# Altium schematic sheet SoC_PS_Config_503.SchDoc: RFSoC AMC
size 420 x 297 mm; CompanyName: WUT; DrawnBy: T. Przywozki; Organization: WUT ISE; Address1: Warsaw University of Technology; Address2: Nowowiejska 15/19 00-665 Warsaw; Address3: Tomasz.Przywozki@pw.edu.pl; DocumentNumber: 9; Revision: 1; SheetNumber: 9; SheetTotal: 45; Project: RFSoC AMC; ModifiedBy: T. Przywozki; CreateDate: -; CheckedDate: -; DivGrp: ISE; Designer: T. Przywozki; ModifiedDate: -; ProjectName: ADC/DAC MEZZANINE
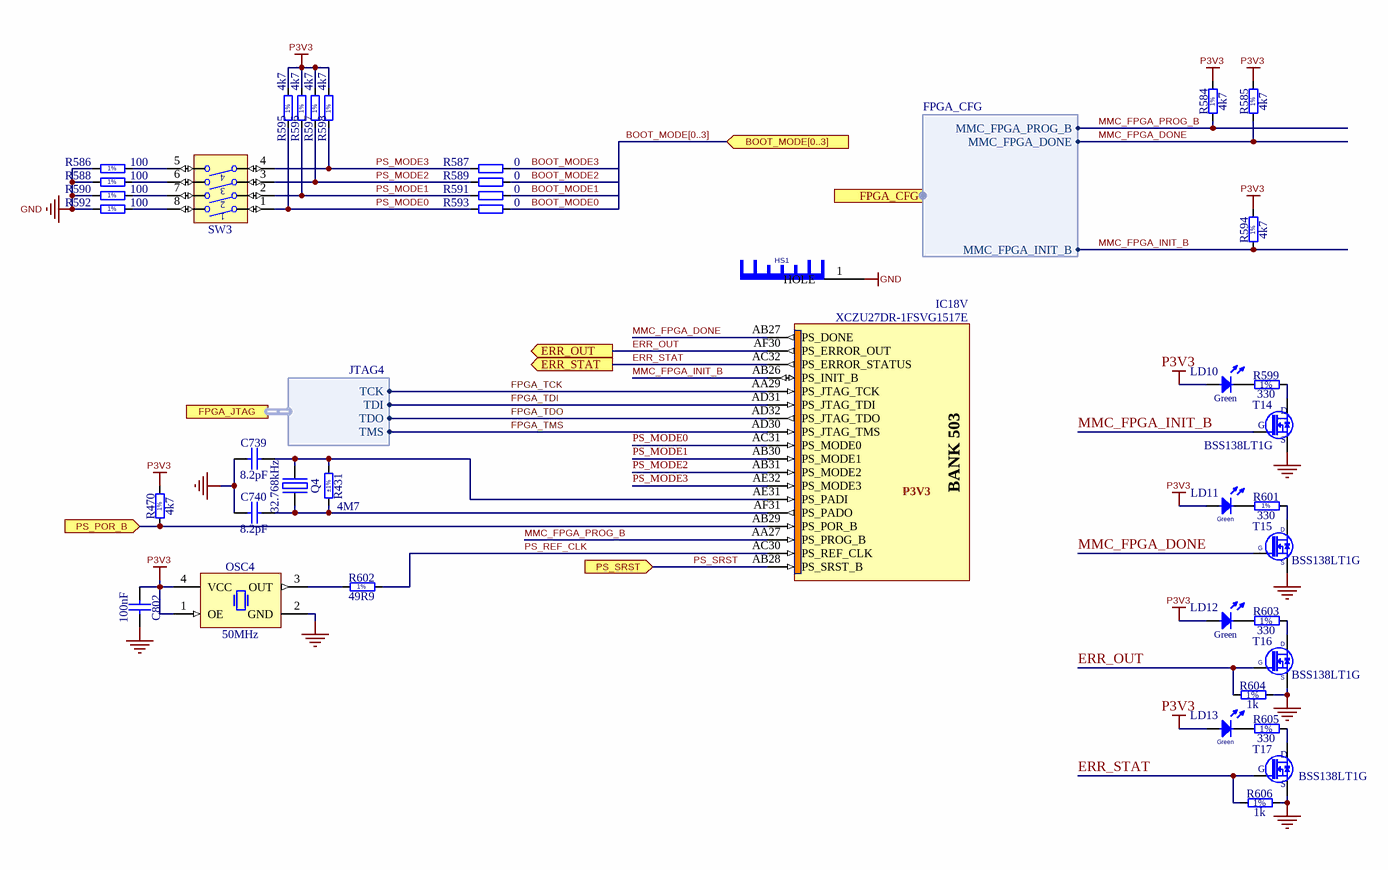
[diagram p0: SoC_PS_Config_503.SchDoc]

## Parts
C739  8.2pF  [CAPC1005X55N]
C740  8.2pF  [CAPC1005X55N]
C802  100nF  [CAPC0603X33N]
HS1  Heat Sink No Pad  [HSINK_WAKEFIELD_SKV585811-CU]  (value not drawn)
IC18  XCZU27DR-1FSVG1517E  [XILINX_FSVG1517 (XCZU27DR)]  (part V of 31)
LD10  Green  [LED_AVAGO_HSME-C120]
LD11  Green  [LED_AVAGO_HSME-C120]
LD12  Green  [LED_KINGBRIGHT_KPH-1608CGCK]
LD13  Green  [LED_KINGBRIGHT_KPH-1608CGCK]
OSC4  50MHz  [OSCSC254P320X500X130-4N]
Q4  32.768kHz  [XTAL_ABRACON_ABS06]
R431  4M7  Tolerance: ±1%  [RESC1005X40N]
R470  4k7  [RESC1005X40N]
R584  4k7  [RESC1005X40N]
R585  4k7  [RESC1005X40N]
R586  100  [RESC1005X40N]
R587  0  [RESC1005X40N]
R588  100  [RESC1005X40N]
R589  0  [RESC1005X40N]
R590  100  [RESC1005X40N]
R591  0  [RESC1005X40N]
R592  100  [RESC1005X40N]
R593  0  [RESC1005X40N]
R594  4k7  [RESC1005X40N]
R595  4k7  [RESC1005X40N]
R596  4k7  [RESC1005X40N]
R597  4k7  [RESC1005X40N]
R598  4k7  [RESC1005X40N]
R599  330  [RESC1005X40N]
R601  330  [RESC1005X40N]
R602  49R9  [RESC1005X40N]
R603  330  [RESC1005X40N]
R604  1k  [RESC1005X40N]
R605  330  [RESC1005X40N]
R606  1k  [RESC1005X40N]
SW3  Switch  [SW_TYCO_1571983-4]  (value not drawn)
T14  BSS138LT1G  [SOT95P240X110-3N]
T15  BSS138LT1G  [SOT95P240X110-3N]
T16  BSS138LT1G  [SOT95P240X110-3N]
T17  BSS138LT1G  [SOT95P240X110-3N]

## Ports
BOOT_MODE[0..3] (in), ERR_OUT (out), ERR_STAT (out), FPGA_CFG (harness FPGA_CFG), FPGA_JTAG (harness JTAG4), PS_POR_B (in), PS_SRST (in)

## Harnesses
JTAG4: TCK, TDI, TDO, TMS
FPGA_CFG: MMC_FPGA_PROG_B, MMC_FPGA_DONE, MMC_FPGA_INIT_B

## Nets
GND: C739.1 C740.1 C802.2 HS1.1(HOLE) OSC4.2(GND) R586.1 R588.1 R590.1 R592.1 R604.2 R606.2 T14.2(S) T15.2(S) T16.2(S) T17.2(S)
P3V3: C802.1 LD10.2(A) LD11.2(A) LD12.2(A) LD13.2(A) OSC4.1(OE) OSC4.4(VCC) R470.2 R584.2 R585.2 R594.2 R595.2 R596.2 R597.2 R598.2
BOOT_MODE0: R593.2
BOOT_MODE1: R591.2
BOOT_MODE2: R589.2
BOOT_MODE3: R587.2
ERR_OUT: IC18.AF30(PS_ERROR_OUT) R604.1 T16.1(G) ; port ERR_OUT
ERR_STAT: IC18.AC32(PS_ERROR_STATUS) R606.1 T17.1(G) ; port ERR_STAT
FPGA_TCK: IC18.AA29(PS_JTAG_TCK) ; port FPGA_JTAG.TCK
FPGA_TDI: IC18.AD31(PS_JTAG_TDI) ; port FPGA_JTAG.TDI
FPGA_TDO: IC18.AD32(PS_JTAG_TDO) ; port FPGA_JTAG.TDO
FPGA_TMS: IC18.AD30(PS_JTAG_TMS) ; port FPGA_JTAG.TMS
MMC_FPGA_DONE: IC18.AB27(PS_DONE) R585.1 T15.1(G) ; port FPGA_CFG.MMC_FPGA_DONE
MMC_FPGA_INIT_B: IC18.AB26(PS_INIT_B) R594.1 T14.1(G) ; port FPGA_CFG.MMC_FPGA_INIT_B
MMC_FPGA_PROG_B: IC18.AA27(PS_PROG_B) R584.1 ; port FPGA_CFG.MMC_FPGA_PROG_B
PS_MODE0: IC18.AC31(PS_MODE0) R593.1 R595.1 SW3.1
PS_MODE1: IC18.AB30(PS_MODE1) R591.1 R596.1 SW3.2
PS_MODE2: IC18.AB31(PS_MODE2) R589.1 R597.1 SW3.3
PS_MODE3: IC18.AE32(PS_MODE3) R587.1 R598.1 SW3.4
PS_POR_B: IC18.AB29(PS_POR_B) R470.1 ; port PS_POR_B
PS_REF_CLK: IC18.AC30(PS_REF_CLK) R602.2
PS_SRST: IC18.AB28(PS_SRST_B) ; port PS_SRST
NetC739_2: C739.2 IC18.AE31(PS_PADI) Q4.1(OSC1) R431.1
NetC740_2: C740.2 IC18.AF31(PS_PADO) Q4.2(OSC2) R431.2
NetLD10_1: LD10.1(C) R599.1
NetLD11_1: LD11.1(C) R601.1
NetLD12_1: LD12.1(C) R603.1
NetLD13_1: LD13.1(C) R605.1
NetOSC4_3: OSC4.3(OUT) R602.1
NetR586_2: R586.2 SW3.5
NetR588_2: R588.2 SW3.6
NetR590_2: R590.2 SW3.7
NetR592_2: R592.2 SW3.8
NetR599_2: R599.2 T14.3(D)
NetR601_2: R601.2 T15.3(D)
NetR603_2: R603.2 T16.3(D)
NetR605_2: R605.2 T17.3(D)

## Buses and harness runs
bus BOOT_MODE[0..3] = port BOOT_MODE[0..3]

## Notes on the sheet
- P3V3
- Project/Equipment
- Document
- Designer
- Drawn by
- Check.by
- Copyright WUT ISE 2021
  This documentation describes Open Hardware and is licensed under CERN OHL v.1.1. You may redistribute and modify this documentaction under the terms of the CERN OHL v1.1.
  (http://ohwr.org/CERNOHL). This documentation is dristributed WITHOUT ANY EXPRESS OR IMPLIED WARRANTY, INCLUDING OF MERCHANTABLITY, SATISFACTORY QUALITY AND FITNESS FOR A PARTICULAR PURPOSE. Please see the CERN OHL v.1.1 for applicable conditions
- File
- Last Mod.
- Print Date
- Sheet
- Size
- A3
- of
- Rev
- Contact:
- (in symbol R0402_1K_1%_0.0625W_100PPM) 1%
- (in symbol R0402_4K7_1%_0.0625W_100PPM) 1%
- (in symbol R0402_49R9_1%_0.0625W_100PPM) 1%
- (in symbol R0402_100R_1%_0.1W_100PPM) 1%
- (in symbol R0402_330R_1%_0.0625W_100PPM) 1%
- (in symbol XCZU27DR-1FSVG1517E, part V) BANK 503

## Library data of the parts
C739 C740 = CC0402_8.2PF_50V_0.1PF_NP0_AVX_04025A8R2BAT2A: Non-polarised capacitor; Part Description: SMD Multilayer Chip Ceramic Capacitor; Manufacturer: AVX; Voltage: 50V; Tolerance: ±0.1pF; Part Number: CC0402_8.2PF_50V_0.1PF_NP0_AVX_04025A8R2BAT2A; Component Kind: Standard; Component Type: Standard; Pin Count: 2; Value: 8.2pF; Status: None; Manufacturer Part Number: 04025A8R2BAT2A; Case: 0402; Mounted: Yes; Socket: No; SMD: Yes; Sense: No; ComponentHeight: 0.55mm; HelpURL: \\cern.ch\dfs\Applications\Altium\Datasheets\CC0402_C0G_AVX.pdf; Author: CERN DEM BC; CreateDate: 16.07.2020; LatestRevisionDate: 16.07.2020
C802 = CC0201_100NF_6.3V_10%_X5R: Non-polarised capacitor; Manufacturer: GENERIC; Part Description: SMD Multilayer Chip Ceramic Capacitor; Manufacturer1 Part Number: 02016D104KAT2A; Tolerance: ±10%; Voltage: 6.3V; TC: X5R; Manufacturer Part Number: CC0201_100NF_6.3V_10%_X5R; Part Number: CC0201_100NF_6.3V_10%_X5R; Value: 100nF; Component Kind: Standard; Component Type: Standard; Pin Count: 2; Status: Not Recommended; Case: 0201; Mounted: Yes; Socket: No; SMD: Yes; Sense: No; Manufacturer1 Example: AVX; Manufacturer1 ComponentHeight: 0.33mm; HelpURL: \\cern.ch\dfs\Applications\Altium\Datasheets\CC0201_X5R_AVX.pdf; Author: CERN DEM JLC; CreateDate: 03.12.2007; LatestRevisionDate: 03.12.2007
HS1 = HSINK_WAKEFIELD_SKV585811-CU: Heat Sink Without Pad; Part Description: Copper Skived Fin Heat Sink, Rth: 7.70°C/W, with Plastic Push Pin Attachement; Manufacturer: WAKEFIELD-VETTE; PressFit: No; Part Number: HSINK_WAKEFIELD_SKV585811-CU; Component Kind: Accessories; Component Type: Standard; Pin Count: 0; PackageDescription: Copper Skived Fin Heat Sink; Body 58mm x 58mm  Height 11mm; Mounted: Yes; Socket: No; SMD: No; Sense: No; Status: None; Manufacturer Part Number: SKV585811-CU; ComponentHeight: 11mm; HelpURL: \\cern.ch\dfs\Applications\Altium\Datasheets\HSINK_WAKEFIELD_SKV585811-CU.pdf; Author: CERN DEM JMW; CreateDate: 26.11.2019; LatestRevisionDate: 26.11.2019
IC18 = XCZU27DR-1FSVG1517E: Zynq UltraScale+ RFSoC, Quad-Core ARM® Cortex™-A53 MPCore™ up to 1.5GHz, 214 PS I/O, 299 HP I/O, 48 HD I/O, 1517-Pin BGA; Manufacturer: XILINX; PressFit: No; Bonding: No; Part Number: XCZU27DR-1FSVG1517E; Component Kind: Standard; Component Type: Standard; Device: XCZU27DR-1FSVG1517E; PackageDescription: BGA, 1.00mm Pitch, Square; 1517 Pin, 39 Columns X 39 Rows, 40.00mm X 40.00mm X 4.01mm H; Part Description: Zynq UltraScale+ RFSoC, Quad-Core ARM® Cortex™-A53 MPCore™ up to 1.5GHz, 214 PS I/O, 299 HP I/O, 48 HD I/O, 1517-Pin BGA; Manufacturer Part Number: XCZU27DR-1FSVG1517E; Pin Count: 1517; Case: BGA1517; Mounted: Yes; Socket: No; SMD: Yes; Sense: No; ComponentHeight: 4.01mm; HelpURL: \\cern.ch\dfs\Applications\Altium\Datasheets\XCZU27DR-1FSVG1517E.pdf; ComponentLink1URL: \\cern.ch\dfs\Applications\Altium\Datasheets\XCZU27DR-1FSVG1517E_Package-Pinout.pdf; ComponentLink1Description: Package/Pinout; ComponentLink2URL: \\cern.ch\dfs\Applications\Altium\Datasheets\XCZU27DR-1FSVG1517E_Pinout.pdf; ComponentLink2Description: Pinout; Author: CERN DEM MR; CreateDate: 02/05/2018; LatestRevisionDate: 02/05/2018
LD10 LD11 = LED_AVAGO_HSME-C120: LED Green 1C 2A; Manufacturer: AVAGO TECHNOLOGIES; Part Description: High Performance Right Angle Chip Green LED; PressFit: No; Bonding: No; Manufacturer Part Number: HSME-C120; PackageDescription: Green Chip LED, 2-Leads, Body 1.7x1.1mm, Side Emitting Package; Part Number: LED_AVAGO_HSME-C120; Component Kind: Standard; Component Type: Standard; Color: Green; Pin Count: 2; Mounted: Yes; Socket: No; SMD: Yes; Sense: No; ComponentHeight: 0.7mm; HelpURL: \\cern.ch\dfs\Applications\Altium\Datasheets\LED_AVAGO_HSME-C120.pdf; ComponentLink1URL: \\cern.ch\dfs\Applications\Altium\Datasheets\LED_AVAGO_HSME-C110_DESIGN-GUIDE.pdf; ComponentLink1Description: Design Guide; Author: CERN DEM JMW; CreateDate: 22.07.2009; LatestRevisionDate: 20.06.2012
LD12 LD13 = LED_KINGBRIGHT_KPH-1608CGCK: LED Green 1C 2A; Part Description: SMD Green LED, Case 1.6mmX0.8mm(0603), 0.65mm Thickness; PressFit: No; Bonding: No; Manufacturer Part Number: KPH-1608CGCK; Manufacturer: KINGBRIGHT; PackageDescription: SMT Green LED, Case 0603, Body L 1.6 x W 0.8mm H 0.65mm; Part Number: LED_KINGBRIGHT_KPH-1608CGCK; Component Kind: Standard; Component Type: Standard; Color: Green; Pin Count: 2; Mounted: Yes; Socket: No; SMD: Yes; Sense: No; ComponentHeight: 0.65mm; HelpURL: \\cern.ch\dfs\Applications\Altium\Datasheets\LED_KINGBRIGHT_KPH-1608CGCK.pdf; Author: CERN DEM JLC; CreateDate: 03.07.2017; LatestRevisionDate: 03.07.2017
OSC4 = OSC_50MHZ_CTS_636L3I050M00000: Oscillator 4 pins 1=OE 2=GND 3=OUT 4=VCC; Part Description: 3.3V, ±50ppm, 30pF, -40..85°C, HCMOS/TTL Clock Oscillator, 636 Series; Manufacturer: CTS ELECTRONIC COMPONENTS; PressFit: No; Bonding: No; Part Number: OSC_50MHZ_CTS_636L3I050M00000; Component Kind: Standard; Component Type: Standard; PackageDescription: Oscillator, Side Concave; 2.54mm Pitch; 4 pin, 3.20mm L X 5.00mm W X 1.30mm H, IPC Medium Density; Value: 50MHz; Manufacturer Part Number: 636L3I050M00000; Pin Count: 4; Mounted: Yes; Socket: No; SMD: Yes; Sense: No; ComponentHeight: 1.3mm; HelpURL: \\cern.ch\dfs\Applications\Altium\Datasheets\OSC_CTS_636.pdf; Author: CERN DEM JMW; CreateDate: 22.09.2015; LatestRevisionDate: 22.09.2015
Q4 = XTAL_32.768KHZ_ABRACON_ABS06-32.768KHZ-9: Quartz Crystal; Part Description: Tolerance: ±20ppm, -40°C to +85°C, 9pF, SMD Low Profile Crystal, ABS06 Series; PressFit: No; Bonding: No; Manufacturer Part Number: ABS06-32.768kHz-9; Manufacturer: ABRACON; PackageDescription: 2 Pins, 2.15x1.3mm, SMD Low Profile Crystal, ABS06 Series; Part Number: XTAL_32.768KHZ_ABRACON_ABS06-32.768KHZ-9; Value: 32.768kHz; Component Kind: Standard; Component Type: Standard; Pin Count: 2; Mounted: Yes; Socket: No; SMD: Yes; Sense: No; ComponentHeight: 0.6mm; HelpURL: \\cern.ch\dfs\Applications\Altium\Datasheets\XTAL_ABRACON_ABS06.pdf; Author: CERN DEM JMW; CreateDate: 12.08.2015; LatestRevisionDate: 12.08.2015
R431 = R0402_4M7_1%_0.063W_100PPM: Resistor - 1%; Part Description: General Purpose Thick Film Chip Resistor; Manufacturer: GENERIC; Manufacturer1 Part Number: CRCW04024M70FK; Power: 0.063W; TC: ±100ppm/°C; PressFit: No; Part Number: R0402_4M7_1%_0.063W_100PPM; Component Kind: Standard; Component Type: Standard; Pin Count: 2; Value: 4M7; Status: None; Manufacturer Part Number: R0402_4M7_1%_0.063W_100PPM; Case: 0402; Mounted: Yes; Sense: No; Socket: No; SMD: Yes; Manufacturer1 Example: VISHAY; Manufacturer1 ComponentHeight: 0.4mm; HelpURL: \\cern.ch\dfs\Applications\Altium\Datasheets\R0402_VISHAY_CRCW e3.pdf; Author: CERN DEM BC; CreateDate: 27.02.2020; LatestRevisionDate: 27.02.2020
R470 R584 R585 R594 = R0402_4K7_1%_0.0625W_100PPM: Resistor - 1%; Manufacturer: GENERIC; Part Description: General Purpose Thick Film Chip Resistor; Manufacturer1 Part Number: 232270674702L; TC: ±100ppm/°C; PressFit: No; Manufacturer Part Number: R0402_4K7_1%_0.0625W_100PPM; Part Number: R0402_4K7_1%_0.0625W_100PPM; Tolerance: ±1%; Value: 4k7; Component Kind: Standard; Component Type: Standard; Pin Count: 2; Status: Not Recommended; Power: 0.0625W; Case: 0402; Mounted: Yes; Sense: No; Socket: No; SMD: Yes; Manufacturer1 Example: YAGEO PHYCOMP; Manufacturer1 ComponentHeight: 0.4mm; HelpURL: \\cern.ch\dfs\Applications\Altium\Datasheets\R0402_Phycomp_RC0402.pdf; Author: CERN DEM JLC; CreateDate: 03.12.2007; LatestRevisionDate: 17.10.2012
R586 R588 R590 R592 = R0402_100R_1%_0.1W_100PPM: Resistor - 1%; Manufacturer Part Number: R0402_100R_1%_0.1W_100PPM_50V; Manufacturer: GENERIC; Part Description: General Purpose Thick Film Chip Resistor; Manufacturer1 Part Number: ERJ2RKF1000X; Power: 0.1W; TC: ±100ppm/°C; Voltage: 50V; PressFit: No; Part Number: R0402_100R_1%_0.1W_100PPM; Tolerance: ±1%; Value: 100; Component Kind: Standard; Component Type: Standard; Pin Count: 2; Status: Not Recommended; Case: 0402; Mounted: Yes; Sense: No; Socket: No; SMD: Yes; Manufacturer1 Example: PANASONIC; Manufacturer1 ComponentHeight: 0.4mm; HelpURL: \\cern.ch\dfs\Applications\Altium\Datasheets\R0402_PANASONIC_ERJ2RK.pdf; Author: CERN DEM JLC; CreateDate: 12.12.2013; LatestRevisionDate: 03.03.2015
R587 R589 R591 R593 = R0402_0R_JUMPER: Resistor; Manufacturer: GENERIC; Part Description: 1A (0.05R Max DC Resistance) Zero Ohm Jumper; Manufacturer1 Part Number: 232270591001L; PressFit: No; Manufacturer Part Number: R0402_0R_JUMPER; Part Number: R0402_0R_JUMPER; Value: 0; Component Kind: Standard; Component Type: Standard; Pin Count: 2; Status: Not Recommended; Case: 0402; Mounted: Yes; Sense: No; Socket: No; SMD: Yes; Manufacturer1 Example: YAGEO PHYCOMP; Manufacturer1 ComponentHeight: 0.4mm; HelpURL: \\cern.ch\dfs\Applications\Altium\Datasheets\R0402_Phycomp_RC0402.pdf; Author: CERN DEM JLC; CreateDate: 03.12.2007; LatestRevisionDate: 17.10.2012
R595-R598 = R0402_4K7_1%_0.0625W_100PPM: Resistor - 1%; Part Description: General Purpose Thick Film Chip Resistor; Manufacturer: GENERIC; Manufacturer1 Part Number: 232270674702L; TC: ±100ppm/°C; PressFit: No; Part Number: R0402_4K7_1%_0.0625W_100PPM; Component Kind: Standard; Component Type: Standard; Pin Count: 2; Value: 4k7; Status: Not Recommended; Power: 0.0625W; Tolerance: ±1%; Manufacturer Part Number: R0402_4K7_1%_0.0625W_100PPM; Case: 0402; Mounted: Yes; Sense: No; Socket: No; SMD: Yes; Manufacturer1 Example: YAGEO PHYCOMP; Manufacturer1 ComponentHeight: 0.4mm; HelpURL: \\cern.ch\dfs\Applications\Altium\Datasheets\R0402_Phycomp_RC0402.pdf; Author: CERN DEM JLC; CreateDate: 03.12.2007; LatestRevisionDate: 17.10.2012
R599 R601 R603 R605 = R0402_330R_1%_0.0625W_100PPM: Resistor - 1%; Manufacturer: GENERIC; Part Description: General Purpose Thick Film Chip Resistor; Manufacturer1 Part Number: 232270673301L; TC: ±100ppm/°C; PressFit: No; Manufacturer Part Number: R0402_330R_1%_0.0625W_100PPM; Part Number: R0402_330R_1%_0.0625W_100PPM; Tolerance: ±1%; Value: 330; Component Kind: Standard; Component Type: Standard; Pin Count: 2; Status: Not Recommended; Power: 0.0625W; Case: 0402; Mounted: Yes; Sense: No; Socket: No; SMD: Yes; Manufacturer1 Example: YAGEO PHYCOMP; Manufacturer1 ComponentHeight: 0.4mm; HelpURL: \\cern.ch\dfs\Applications\Altium\Datasheets\R0402_Phycomp_RC0402.pdf; Author: CERN DEM JLC; CreateDate: 03.12.2007; LatestRevisionDate: 17.10.2012
R602 = R0402_49R9_1%_0.0625W_100PPM: Resistor - 1%; Manufacturer: GENERIC; Part Description: General Purpose Thick Film Chip Resistor; Manufacturer1 Part Number: 232270674999L or RC0402FR-0749R9L; TC: ±100ppm/°C; PressFit: No; Manufacturer Part Number: R0402_49R9_1%_0.0625W_100PPM; Part Number: R0402_49R9_1%_0.0625W_100PPM; Tolerance: ±1%; Value: 49R9; Component Kind: Standard; Component Type: Standard; Pin Count: 2; Status: Not Recommended; Power: 0.0625W; Case: 0402; Mounted: Yes; Sense: No; Socket: No; SMD: Yes; Manufacturer1 Example: YAGEO PHYCOMP; Manufacturer1 ComponentHeight: 0.4mm; HelpURL: \\cern.ch\dfs\Applications\Altium\Datasheets\R0402_Phycomp_RC0402.pdf; Author: CERN DEM JLC; CreateDate: 24.10.2012; LatestRevisionDate: 24.10.2012
R604 R606 = R0402_1K_1%_0.0625W_100PPM: Resistor - 1%; Manufacturer: GENERIC; Part Description: General Purpose Thick Film Chip Resistor; Manufacturer1 Part Number: 232270671002L; TC: ±100ppm/°C; PressFit: No; Manufacturer Part Number: R0402_1K_1%_0.0625W_100PPM; Part Number: R0402_1K_1%_0.0625W_100PPM; Tolerance: ±1%; Value: 1k; Component Kind: Standard; Component Type: Standard; Pin Count: 2; Status: Not Recommended; Power: 0.0625W; Case: 0402; Mounted: Yes; Sense: No; Socket: No; SMD: Yes; Manufacturer1 Example: YAGEO PHYCOMP; Manufacturer1 ComponentHeight: 0.4mm; HelpURL: \\cern.ch\dfs\Applications\Altium\Datasheets\R0402_Phycomp_RC0402.pdf; Author: CERN DEM JLC; CreateDate: 03.12.2007; LatestRevisionDate: 17.10.2012
SW3 = SW_TYCO_1571983-4: 4 Ways SPST DIP Switch; Manufacturer Part Number: 1571983-4 or GDH04S04; Manufacturer: TYCO; Part Description: 4 Way SPST SMD DIP Switch, Latched, Contact Rating 0.025A 24VDC; PressFit: No; PackageDescription: Pitch 1.27mm,  Body 6.2x6.2mm, 4 Ways SPST Surface-Mount DIP Switch, TYCO GDH Series; Part Number: SW_TYCO_1571983-4; Component Kind: Standard; Component Type: Standard; Pin Count: 8; Family: Switch; Mounted: Yes; Socket: No; SMD: Yes; Sense: No; Status: None; ComponentHeight: 2.31mm; HelpURL: \\cern.ch\dfs\Applications\Altium\Datasheets\SW_TYCO_1571983-4.pdf; Author: CERN DEM JLC; CreateDate: 08.01.2009; LatestRevisionDate: 08.01.2009
T14-T17 = BSS138LT1G: N-CHANNEL MOSFET WITH DIODE; Manufacturer: ON SEMICONDUCTOR; Part Description: 50V 200mA N-Channel Enhancement Mode Field-Effect Transistor; PressFit: No; Bonding: No; Manufacturer Part Number: BSS138LT1G; PackageDescription: SOT23 3-Leads, Pitch 0.95mm - Body 1.4x3mm, IPC Medium Density; Part Number: BSS138LT1G; Component Kind: Standard; Component Type: Standard; Device: BSS138LT1G; Pin Count: 3; Case: SOT23-3; Mounted: Yes; Socket: No; SMD: Yes; Sense: No; ComponentHeight: 1.11mm; HelpURL: \\cern.ch\dfs\Applications\Altium\Datasheets\BSS138LT1G.pdf; Author: CERN DEM JLC; CreateDate: 23.03.2009; LatestRevisionDate: 23.03.2009